# Altium schematic sheet PCB.SchDoc
size A4; PageSetup: Record=PageOptions|CenterHorizontal=True|CenterVertical=True|PrintScale=1.00|XCorrection=1.00|YCorrection=1.00|PrintKind=0|BorderSize=5000000|LeftOffset=0|BottomOffset=0|Orientation=2|PaperLength=1000|PaperWidth=1000|Scale=100|PaperSource=7|PrintQuality=-3|MediaType=1|DitherType=10|PrintScaleMode=1|PaperKind=A4|PaperIndex=9
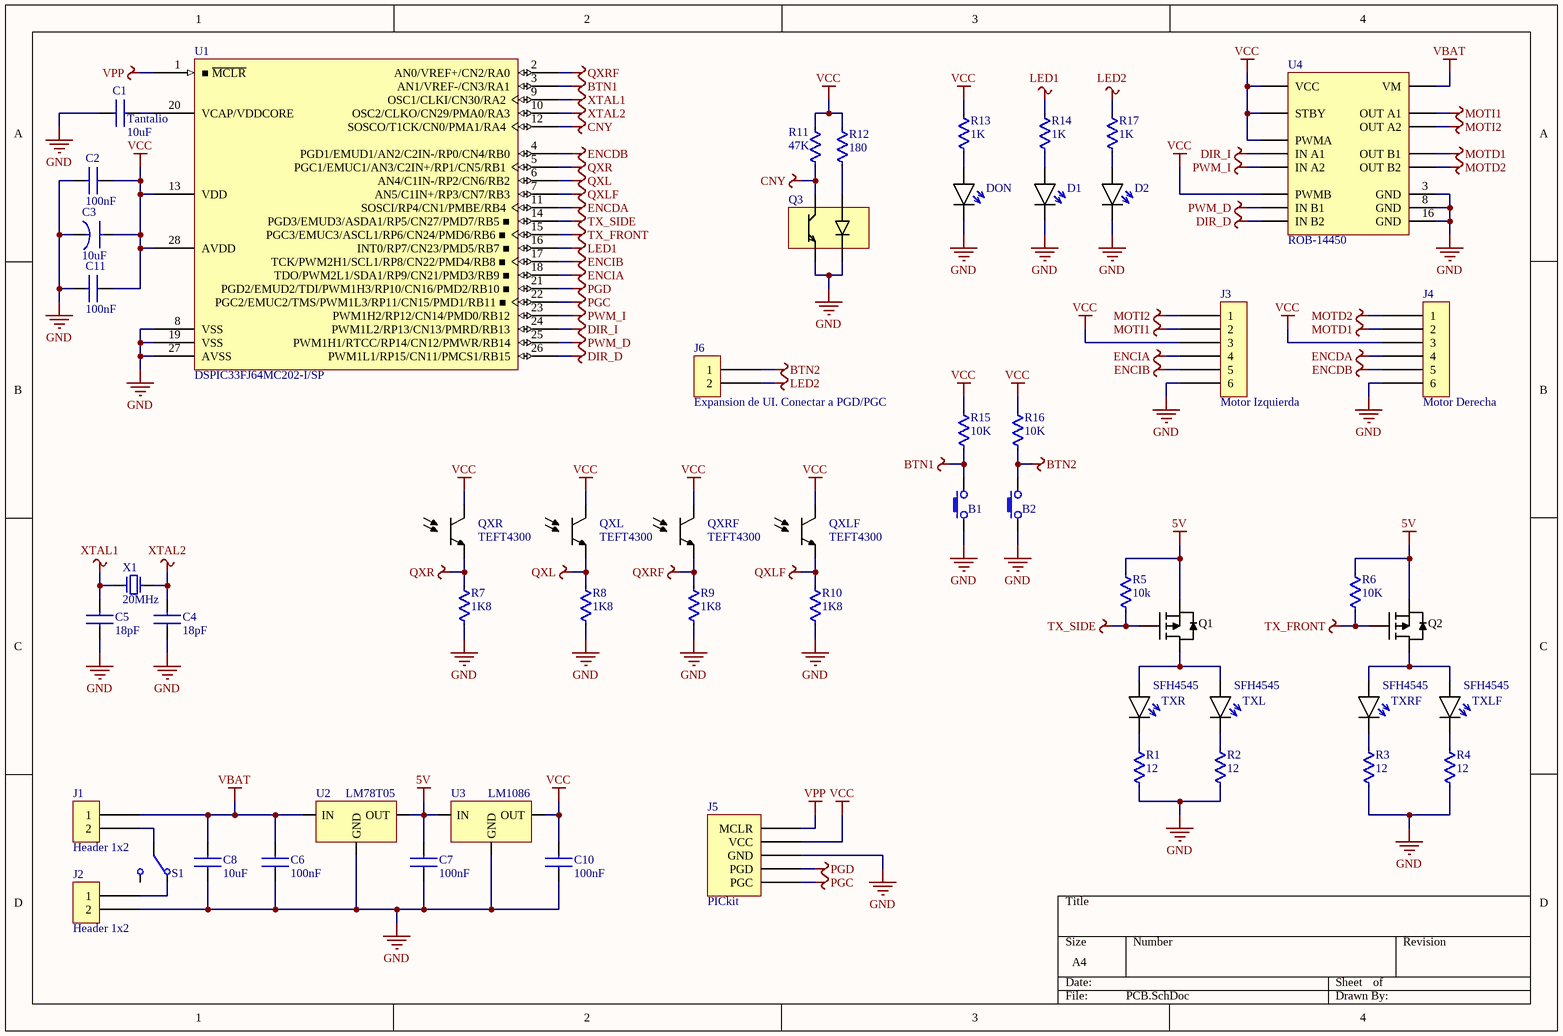
[diagram p0: PCB.SchDoc]

## Parts
B1  BUTTON  [TACT_SWITCH-SMALL-4PIN]  (value not drawn)
B2  BUTTON  [TACT_SWITCH-SMALL-4PIN]  (value not drawn)
C1  Tantalio  value 10uF  [CAP-CER]
C2  value 100nF  [CAP-CER]  (hidden comment: CAP-CER)
C3  value 10uF  [CAP-ELEC-5x11x2mm]  (hidden comment: CAP-ELEC)
C4  value 18pF  [CAP-CER]  (hidden comment: CAP-CER)
C5  value 18pF  [CAP-CER]  (hidden comment: CAP-CER)
C6  value 100nF  [CAP-CER]  (hidden comment: CAP-CER)
C7  value 100nF  [CAP-CER]  (hidden comment: CAP-CER)
C8  value 10uF  [CAP-CER]  (hidden comment: CAP-CER)
C10  value 100nF  [CAP-CER]  (hidden comment: CAP-CER)
C11  value 100nF  [CAP-CER]  (hidden comment: For pin)
D1  LED  [LED-3MM-YELLOW]  (value not drawn)
D2  LED  [LED-3MM-YELLOW]  (value not drawn)
DON  LED  [LED-3MM-RED]  (value not drawn)
J1  Header 1x2  [HEADER 1x2]
J2  Header 1x2  [HEADER 1x2]
J3  Motor Izquierda  [Header 1x6]
J4  Motor Derecha  [Header 1x6]
J5  PICkit  [Header 1x5]
J6  Expansion de UI. Conectar a PGD/PGC  [HEADER 1x2]
Q1  P-MOS  [TO-220]  (value not drawn)
Q2  P-MOS  [TO-220]  (value not drawn)
Q3  QRE1113GR  [QRE1113GR]  (value not drawn)
QXL  TEFT4300  [PHOTO-NPN-2]
QXLF  TEFT4300  [PHOTO-NPN]
QXR  TEFT4300  [PHOTO-NPN]
QXRF  TEFT4300  [PHOTO-NPN-2]
R1  value 12  [RES-Axial-400mil]  (hidden comment: RES)
R2  value 12  [RES-Axial-400mil]  (hidden comment: RES)
R3  value 12  [RES-Axial-400mil]  (hidden comment: RES)
R4  value 12  [RES-Axial-400mil]  (hidden comment: RES)
R5  value 10k  [RES-Axial-400mil]  (hidden comment: RES)
R6  value 10K  [RES-Axial-400mil]  (hidden comment: RES)
R7  value 1K8  [RES VERTICAL]  (hidden comment: RES)
R8  value 1K8  [RES VERTICAL]  (hidden comment: RES)
R9  value 1K8  [RES-Axial-400mil]  (hidden comment: RES)
R10  value 1K8  [RES-Axial-400mil]  (hidden comment: RES)
R11  value 47K  [RES-Axial-400mil]  (hidden comment: RES)
R12  value 180  [RES-Axial-400mil]  (hidden comment: RES)
R13  value 1K  [RES-Axial-400mil]  (hidden comment: RES)
R14  value 1K  [RES VERTICAL]  (hidden comment: RES)
R15  value 10K  [RES-Axial-400mil]  (hidden comment: RES)
R16  value 10K  [RES-Axial-400mil]  (hidden comment: RES)
R17  value 1K  [RES VERTICAL]  (hidden comment: RES)
S1  SLIDE-SWITCH  [SWITCH]  (value not drawn)
TXL  SFH4545  [LED-5MM-RED-90]
TXLF  SFH4545  [LED-5MM-RED-90]
TXR  SFH4545  [LED-5MM-RED-90-2]
TXRF  SFH4545  [LED-5MM-RED-90-2]
U1  DSPIC33FJ64MC202-I/SP  [DIP28]
U2  LM78T05  [TO-220]
U3  LM1086  [TO-220]
U4  ROB-14450  [ROB-14450]
X1  FREQUENCY: 20MHz  [HC-49/S]  (hidden comment: XTAL)

## Nets
5V: C7.2 Q1.S Q2.S R5.2 R6.2 U2.3(OUT) U3.1(IN)
BTN1: B1.2 R15.1 U1.3(AN1/VREF-/CN3/RA1)
BTN2: B2.2 J6.1 R16.1
CNY: Q3.C R11.1 U1.12(SOSCO/T1CK/CN0/PMA1/RA4)
DIR_D: U1.26(PWM1L1/RP15/CN11/PMCS1/RB15) U4.14(IN_B2)
DIR_I: U1.24(PWM1L2/RP13/CN13/PMRD/RB13) U4.11(IN_A1)
ENCDA: J4.4 U1.11(SOSCI/RP4/CN1/PMBE/RB4)
ENCDB: J4.5 U1.4(PGD1/EMUD1/AN2/C2IN-/RP0/CN4/RB0)
ENCIA: J3.4 U1.18(TDO/PWM2L1/SDA1/RP9/CN21/PMD3/RB9_■)
ENCIB: J3.5 U1.17(TCK/PWM2H1/SCL1/RP8/CN22/PMD4/RB8_■)
GND: B1.1 B2.1 C1.1 C2.2 C3.2 C4.2 C5.2 C6.1 C7.1 C8.1 C10.1 C11.2 D1.K D2.K DON.K J2.2 J3.6 J4.6 J5.3(GND) Q3.E Q3.K R1.1 R2.1 R3.1 R4.1 R7.1 R8.1 R9.1 R10.1 U1.8(VSS) U1.19(VSS) U1.27(AVSS) U2.2(GND) U3.2(GND) U4.3(GND) U4.8(GND) U4.16(GND)
LED1: R14.2 U1.16(INT0/RP7/CN23/PMD5/RB7_■)
LED2: J6.2 R17.2
MOTD1: J4.2 U4.7(OUT_B1)
MOTD2: J4.1 U4.6(OUT_B2)
MOTI1: J3.2 U4.4(OUT_A1)
MOTI2: J3.1 U4.5(OUT_A2)
PGC: J5.5(PGC) U1.22(PGC2/EMUC2/TMS/PWM1L3/RP11/CN15/PMD1/RB11_■)
PGD: J5.4(PGD) U1.21(PGD2/EMUD2/TDI/PWM1H3/RP10/CN16/PMD2/RB10_■)
PWM_D: U1.25(PWM1H1/RTCC/RP14/CN12/PMWR/RB14) U4.13(IN_B1)
PWM_I: U1.23(PWM1H2/RP12/CN14/PMD0/RB12) U4.10(IN_A2)
QXL: QXL.E R8.2 U1.6(AN4/C1IN-/RP2/CN6/RB2)
QXLF: QXLF.E R10.2 U1.7(AN5/C1IN+/RP3/CN7/RB3)
QXR: QXR.E R7.2 U1.5(PGC1/EMUC1/AN3/C2IN+/RP1/CN5/RB1)
QXRF: QXRF.E R9.2 U1.2(AN0/VREF+/CN2/RA0)
TX_FRONT: Q2.G R6.1 U1.15(PGC3/EMUC3/ASCL1/RP6/CN24/PMD6/RB6_■)
TX_SIDE: Q1.G R5.1 U1.14(PGD3/EMUD3/ASDA1/RP5/CN27/PMD7/RB5_■)
VBAT: C6.2 C8.2 J1.1 U2.1(IN) U4.1(VM)
VCC: C2.1 C3.1 C10.2 C11.1 J3.3 J4.3 J5.2(VCC) QXL.C QXLF.C QXR.C QXRF.C R11.2 R12.2 R13.2 R15.2 R16.2 U1.13(VDD) U1.28(AVDD) U3.3(OUT) U4.2(VCC) U4.9(PWMA) U4.12(STBY) U4.15(PWMB)
VPP: J5.1(MCLR) U1.1(■_~{MCLR})
XTAL1: C5.1 U1.9(OSC1/CLKI/CN30/RA2) X1.1
XTAL2: C4.1 U1.10(OSC2/CLKO/CN29/PMA0/RA3) X1.2
NetC1_2: C1.2 U1.20(VCAP/VDDCORE)
NetD1_A: D1.A R14.1
NetD2_A: D2.A R17.1
NetDON_A: DON.A R13.1
NetJ1_2: J1.2 S1.2
NetJ2_1: J2.1 S1.1
NetQ1_D: Q1.D TXL.A TXR.A
NetQ2_D: Q2.D TXLF.A TXRF.A
NetQ3_A: Q3.A R12.1
NetR1_2: R1.2 TXR.K
NetR2_2: R2.2 TXL.K
NetR3_2: R3.2 TXRF.K
NetR4_2: R4.2 TXLF.K

Not connected (* = marked no-connect by the designer): S1 3

## Library data of the parts
C1 C11 = CAP-CER
J3 J4 = Header 1x6
J6 = Header 1x2
Q1 Q2 = P-MOSFET: pin to pad: D>2 G>1 S>3
Q3 = QRE1113GR: MF: ON Semiconductor; Price: 0.46 USD; MP: QRE1113GR; Package: SMD-4 ON Semiconductor; Availability: Good; Value: *
QXL QXLF QXR QXRF = PHOTO NPN
TXL TXLF TXR TXRF = LED
U1 = DSPIC33FJ64MC202-I/SP: High-Performance 16-bit Digital Signal Controller, 64 KB Flash, 8 KB RAM, 28-Pin SPDIP, Industrial Temperature; Published: 29-Jan-2009; LatestRevisionDate: 02-Dec-2009; LatestRevisionNote: Updated to datasheet revision D, Nov-2009; DatasheetVersion: revD, Nov-2009; PackageVersion: revBB, Aug-2009; PackageReference: SPDIP300-SP28; Publisher: Altium Limited; PackageDescription: 28-Lead Skinny Plastic Dual In-Line (SP) - 300 mil Body [SPDIP]; Supplier 1: Digi-Key; Supplier Part Number 1: DSPIC33FJ64MC202-I/SP-ND; Supplier 2: Farnell; Supplier Part Number 2: 1576836; ComponentLink1Description: Datasheet; ComponentLink1URL: http://ww1.microchip.com/downloads/en/DeviceDoc/70291D.pdf; ComponentLink2Description: Packaging Specification; ComponentLink2URL: http://www.microchip.com/stellent/groups/techpub_sg/documents/packagingspec/en012702.pdf; ComponentLink3Description: Microchip.com Home; ComponentLink3URL: http://www.microchip.com/
U2 U3 = LM78XX
U4 = ROB-14450: Power Management IC Development Tools SparkFun MotorDriver Dual TB6612FNG Head.; Geometry.Height: 5mm; Manufacturer_Name: SparkFun; Manufacturer_Part_Number: ROB-14450; RS Part Number: *; RS Price/Stock: *; Arrow Part Number: ROB-14450; Arrow Price/Stock: *; Datasheet Link: https://www.sparkfun.com/products/14450